# Altium schematic sheet 51-2001-01-3_04 Power Module Schematic.SchDoc
size 431 x 279 mm; Organization: ORGANIZATION; Address1: ADDRESS 1; Address2: ADDRESS 2; Address3: ADDRESS 3; Address4: ADDRESS 4; Revision: -; SheetNumber: 4; SheetTotal: 4; ENG_APP_DATE: --/--/--; DSN_APP_DATE: --/--/--; CHK_APP_DATE: --/--/--
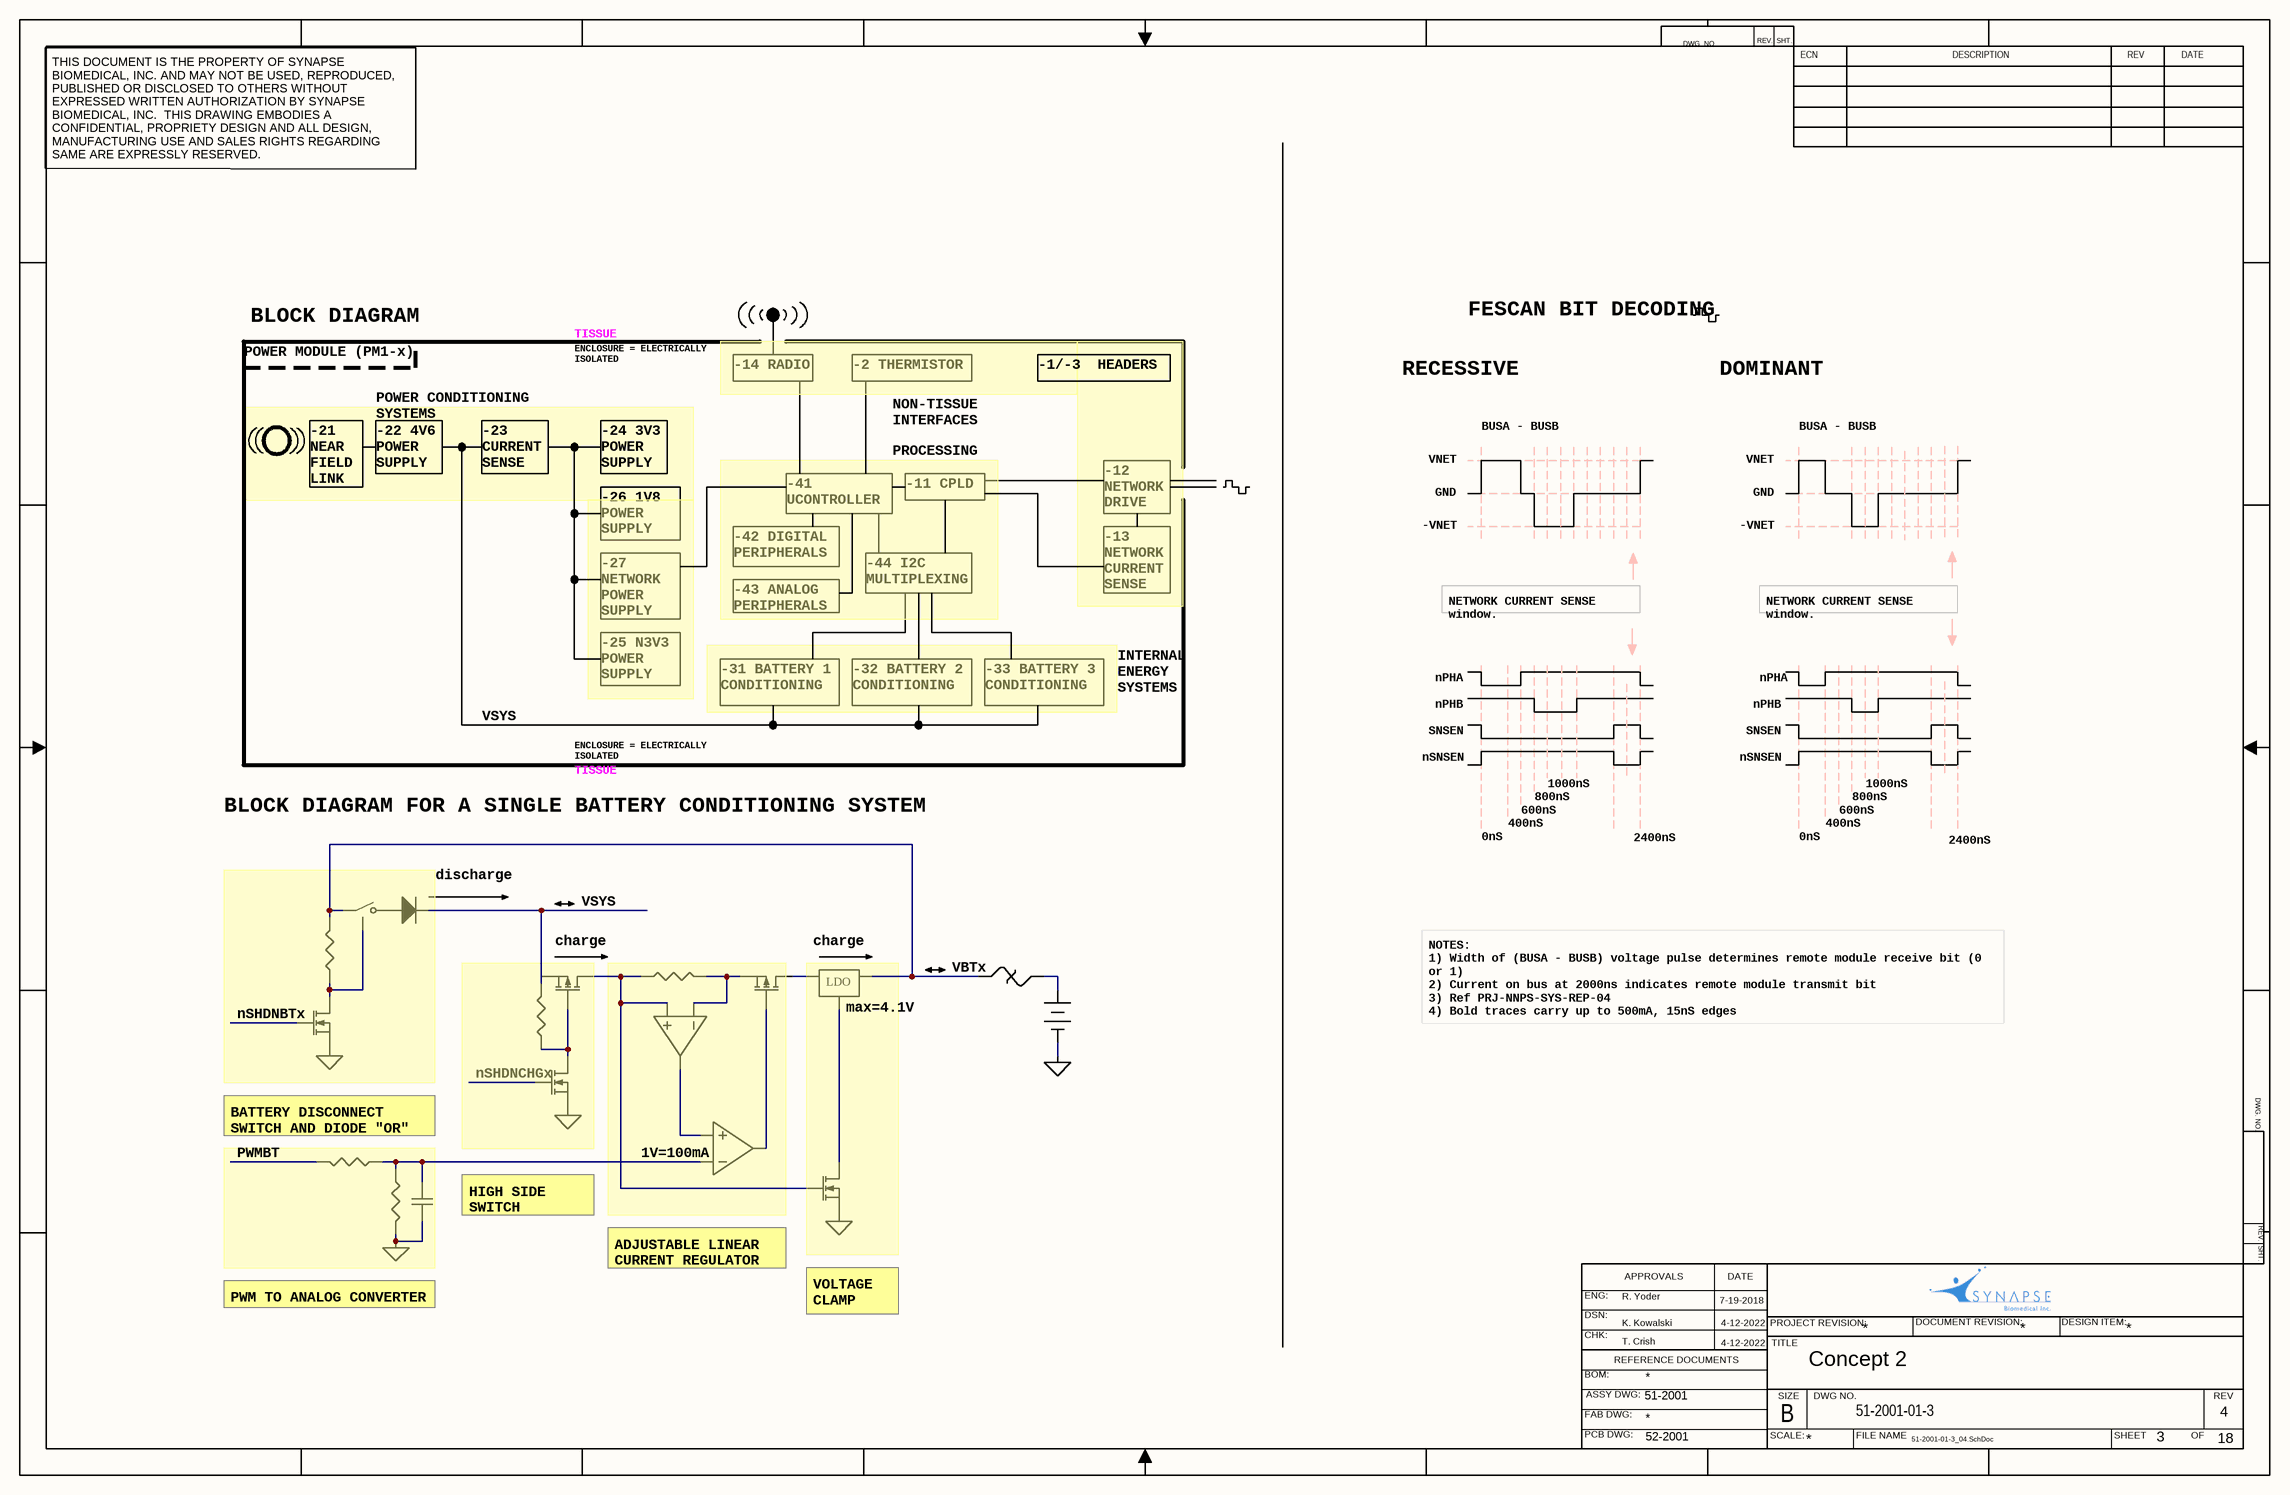
[diagram p0: 51-2001-01-3_04 Power Module Schematic.SchDoc]

## Parts
(Parts that share a designator on the sheet are numbered #1, #2 ... from top to bottom, then left to right.)
C?  C  (value not drawn)  (graphical)
D1  D  (value not drawn)  (graphical)
F1  F  (value not drawn)  (graphical)
M1  MN  (value not drawn)  (graphical)
M2  MP  (value not drawn)  (graphical)
M3  MN  (value not drawn)  (graphical)
M4  MP  (value not drawn)  (graphical)
M5  MN  (value not drawn)  (graphical)
R1  R  (value not drawn)  (graphical)
R2  R  (value not drawn)  (graphical)
R3  R  (value not drawn)  (graphical)
R4  R  (value not drawn)  (graphical)
R5  R  (value not drawn)  (graphical)
U1  SWL  (value not drawn)  (graphical)
U2  OPA  (value not drawn)  (graphical)
U3#1  LDO  (value not drawn)  (graphical)
U3#2  OPA  (value not drawn)  (graphical)
U4  BAT  (value not drawn)  (graphical)

## Blocks framed on the sheet
nSHDNBTx: D1 M1 R1 U1
1V=100mA: M4 R3 U2 U3#2
PWMBT: C? R4 R5

## Nets
GND: C?.2 M1.2(S) M3.2(S) M5.2(S) R5.2 U4.2(-)
NetC?_1: C?.1 R4.1 R5.1 U3#2.2(-IN)
NetD1_1: D1.1(A) U1.2
NetD1_2: D1.2(K) M2.2(S) R2.2
NetF1_1: F1.1 R1.2 U1.1 U3#1.3(OUT)
NetF1_2: F1.2 U4.1(+)
NetM1_3: M1.3(D) R1.1 U1.3
NetM2_1: M2.1(G) M3.3(D) R2.1
NetM2_3: M2.3(D) M5.1(G) R3.1 U2.1(+IN)
NetM4_1: M4.1(G) U3#2.3(OUT)
NetM4_2: M4.2(S) R3.2 U2.2(-IN)
NetM4_3: M4.3(D) U3#1.1(IN)
NetM5_3: M5.3(D) U3#1.2(GND)
NetU2_3: U2.3(OUT) U3#2.1(+IN)

Not connected (* = marked no-connect by the designer): M1 1(G); M3 1(G); R4 2

## Notes on the sheet
- DWG. NO.
- REV.
- SHT.
- ECN
- DESCRIPTION
- REV
- DATE
- THIS DOCUMENT IS THE PROPERTY OF SYNAPSE BIOMEDICAL, INC. AND MAY NOT BE USED, REPRODUCED, PUBLISHED OR DISCLOSED TO OTHERS WITHOUT EXPRESSED WRITTEN AUTHORIZATION BY SYNAPSE BIOMEDICAL, INC.  THIS DRAWING EMBODIES A CONFIDENTIAL, PROPRIETY DESIGN AND ALL DESIGN, MANUFACTURING USE AND SALES RIGHTS REGARDING SAME ARE EXPRESSLY RESERVED.
- POWER MODULE (PM1-x)
- BLOCK DIAGRAM
- TISSUE
- ENCLOSURE = ELECTRICALLY ISOLATED
- -14 RADIO
- -2 THERMISTOR
- -1/-3  HEADERS
- RECESSIVE
- FESCAN BIT DECODING
- DOMINANT
- POWER CONDITIONING SYSTEMS
- NON-TISSUE INTERFACES
- BUSA - BUSB
- -21 NEAR FIELD LINK
- -22 4V6 POWER SUPPLY
- -23 CURRENT SENSE
- -24 3V3 POWER SUPPLY
- -41 UCONTROLLER
- PROCESSING
- -11 CPLD
- -12 NETWORK DRIVE
- VNET
- GND
- -26 1V8 POWER SUPPLY
- -42 DIGITAL PERIPHERALS
- -VNET
- -27 NETWORK  POWER SUPPLY
- -43 ANALOG PERIPHERALS
- -44 I2C MULTIPLEXING
- -13 NETWORK CURRENT SENSE
- NETWORK CURRENT SENSE window.
- -25 N3V3 POWER SUPPLY
- -31 BATTERY 1 CONDITIONING
- -32 BATTERY 2 CONDITIONING
- -33 BATTERY 3 CONDITIONING
- INTERNAL ENERGY SYSTEMS
- nPHA
- nPHB
- VSYS
- nSNSEN
- SNSEN
- BLOCK DIAGRAM FOR A SINGLE BATTERY CONDITIONING SYSTEM
- 0nS
- 400nS
- 600nS
- 800nS
- 1000nS
- 2400nS
- (near D1) discharge
- (near M2) charge
- charge
- (near F1) VBTx
- (near U3#1) max=4.1V
- NOTES:
  1) Width of (BUSA - BUSB) voltage pulse determines remote module receive bit (0 or 1)
  2) Current on bus at 2000ns indicates remote module transmit bit
  3) Ref PRJ-NNPS-SYS-REP-04
  4) Bold traces carry up to 500mA, 15nS edges
- (near M3) nSHDNCHGx
- (near R4) BATTERY DISCONNECT SWITCH AND DIODE "OR"
- (near C?) HIGH SIDE SWITCH
- PWM TO ANALOG CONVERTER
- ADJUSTABLE LINEAR CURRENT REGULATOR
- ENG:
- R. Yoder
- APPROVALS
- 7-19-2018
- VOLTAGE CLAMP
- DSN:
- CHK:
- REFERENCE DOCUMENTS
- K. Kowalski
- T. Crish
- 4-12-2022
- PROJECT REVISION:
- TITLE
- Concept 2
- *
- DOCUMENT REVISION:
- DESIGN ITEM:
- BOM:
- FAB DWG:
- PCB DWG:
- ASSY DWG:
- 51-2001
- SCALE:
- SIZE
- B
- DWG NO.
- 51-2001-01-3
- FILE NAME
- SHEET
- OF
- 4
- 52-2001
- 51-2001-01-3_04.SchDoc
- 3
- 18

## Library data of the parts
C? = C: Capacitor; Value: 1uF
D1 = D: Diode
F1 = F: Fuse
M1 M3 M5 = MN: MOSFET N channel
M2 M4 = MP: MOSFET P channel
R1-R5 = R: Resistor; Value: 1
U1 = SWL: SWitch,Logic controlled
U2 U3#2 = OPA: Op-amp
U4 = BAT: Battery